# Altium schematic sheet SoilMoisture.SchDoc
size A
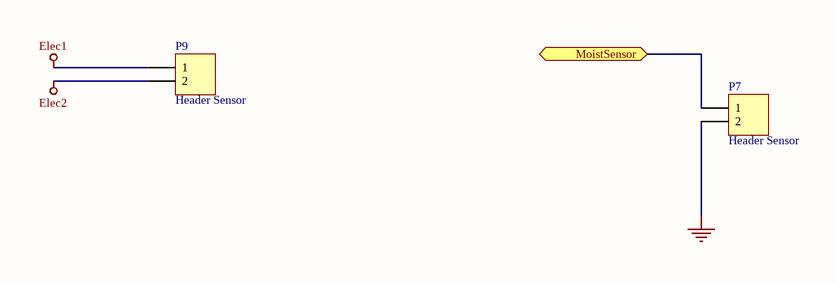
[diagram p0: SoilMoisture.SchDoc]

## Parts
P7  Header Sensor  [BORNIER]
P9  Header Sensor  [BORNIER]

## Ports
MoistSensor (bidir)

## Nets
Elec1: P9.1
Elec2: P9.2
GND: P7.2
MoistSensor: P7.1 ; port MoistSensor

## Library data of the parts
P7 P9 = Header 2: Header, 2-Pin; Manufacturer: BUCHANAN - TE CONNECTIVITY; Ref.Manufacturer: 282834-2; LatestRevisionDate: 17-Jul-2002; LatestRevisionNote: Re-released for DXP Platform.; Publisher: Altium Limited; Ref.Farnell: 2112482; Supplier: Farnell